# EAGLE design qnode8 (EAGLE 7.4.0)
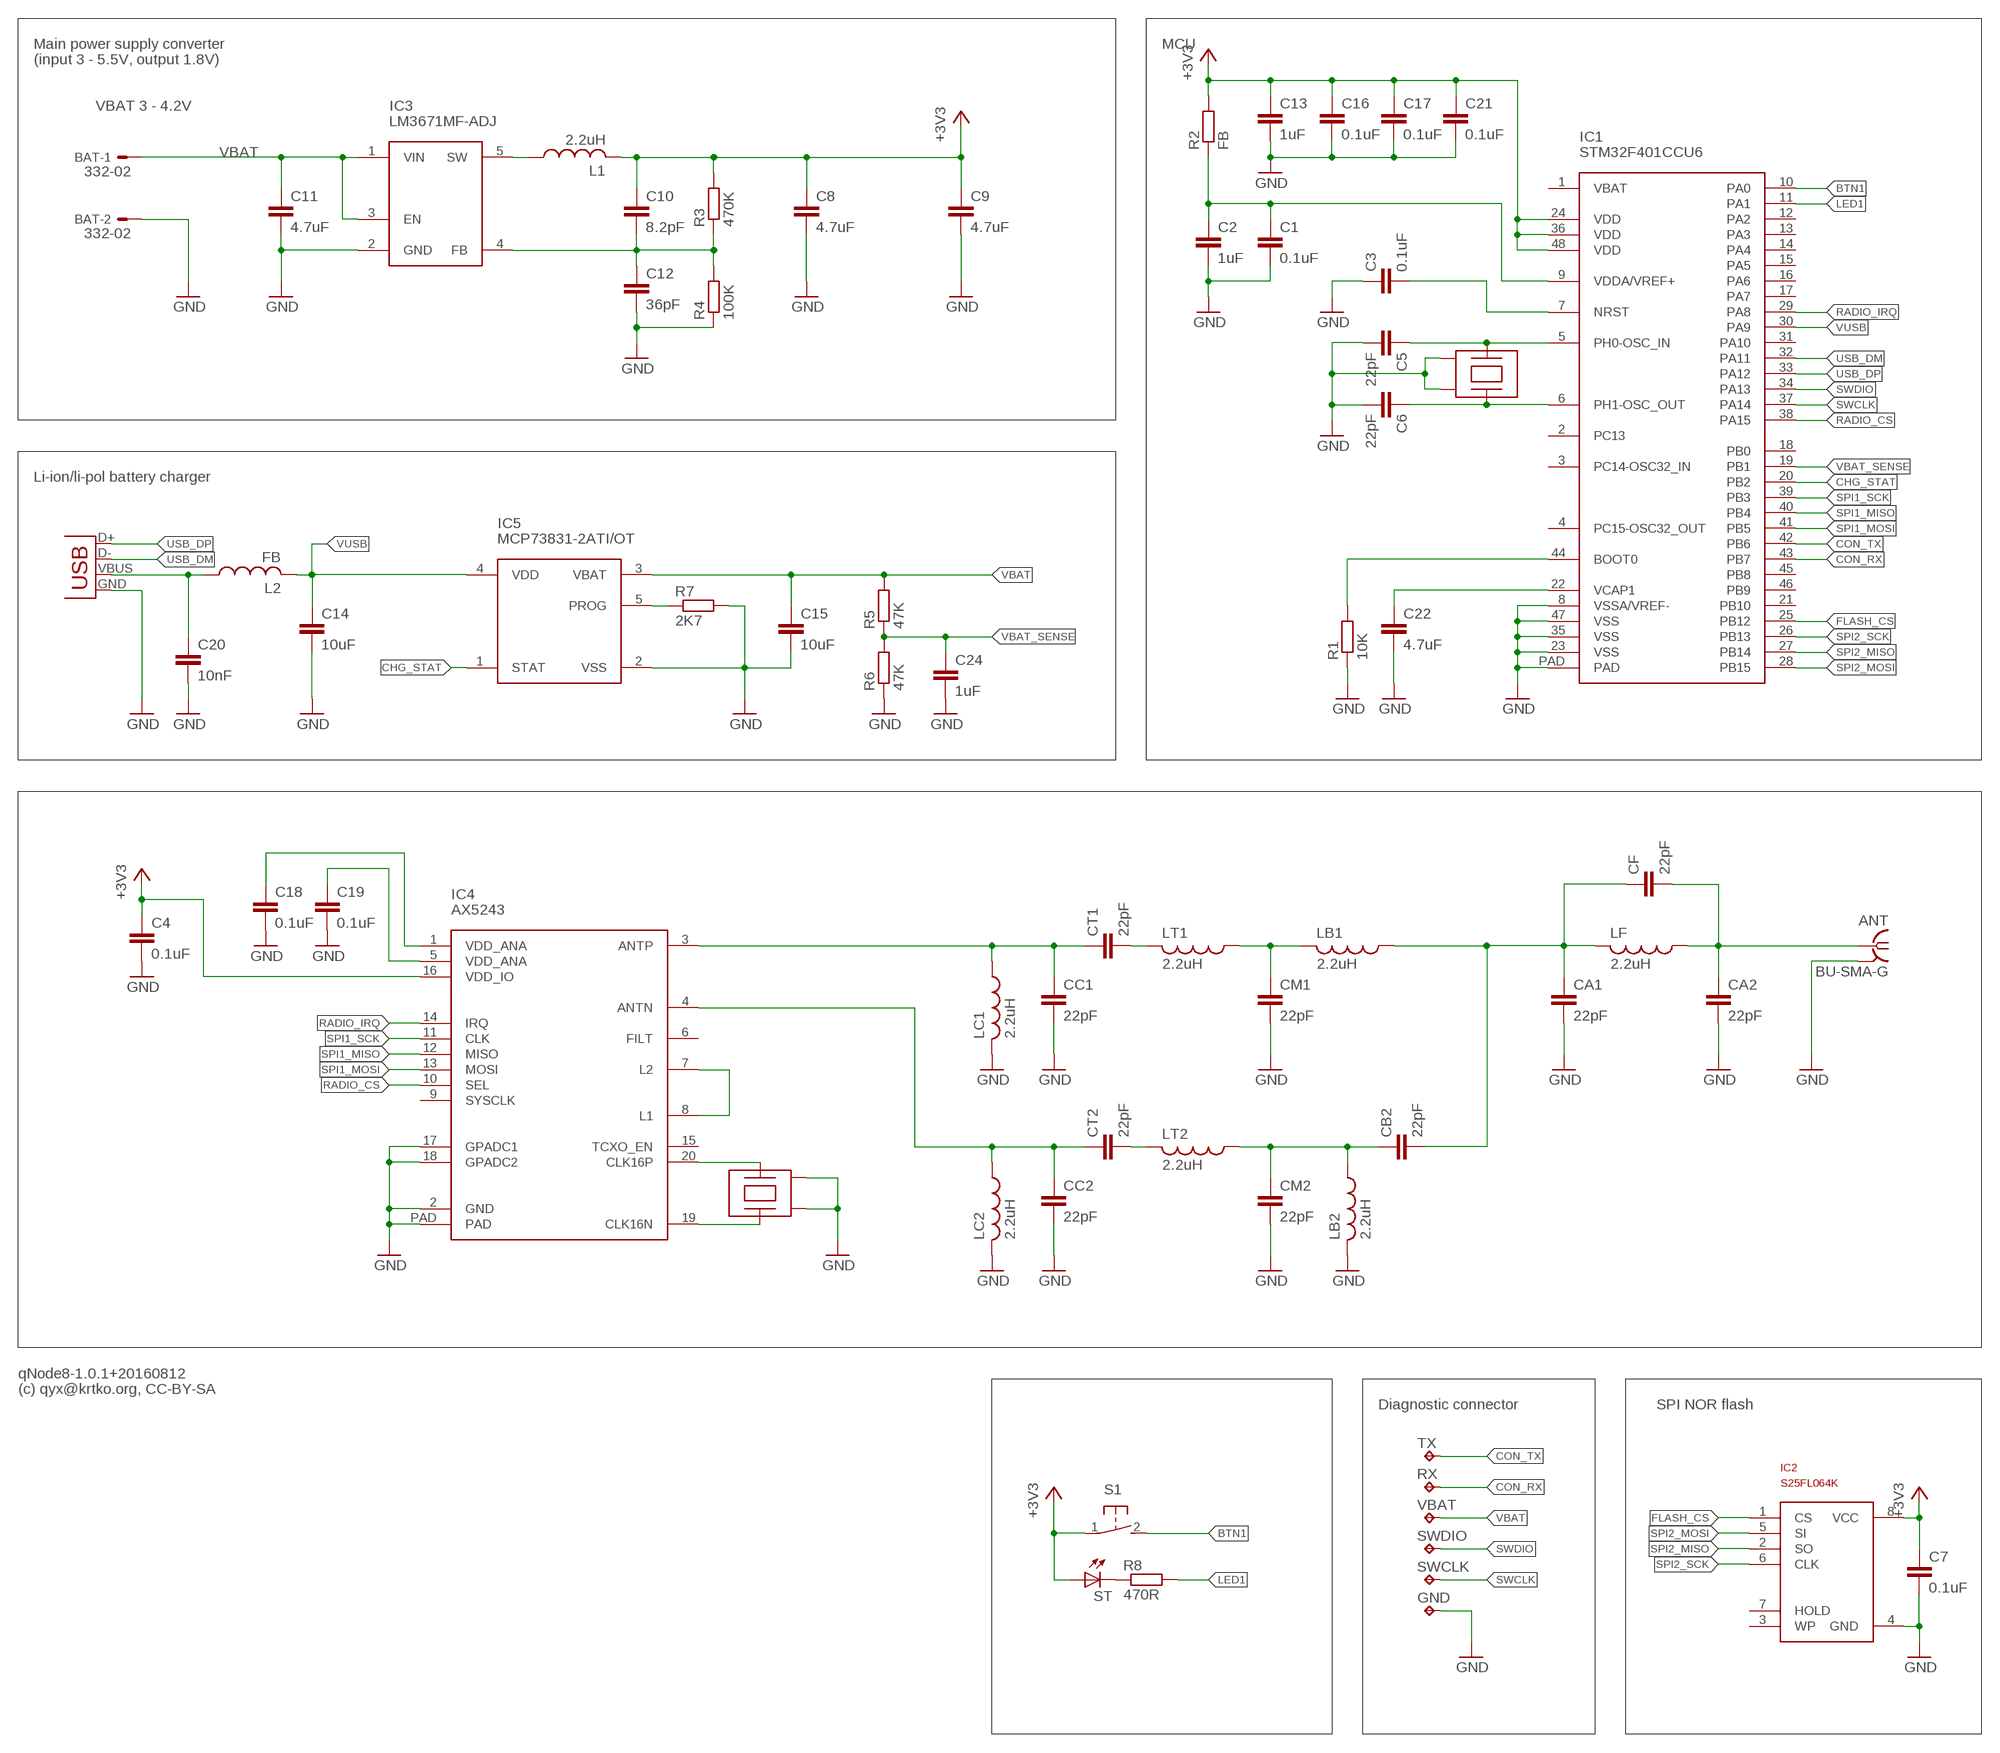
[diagram p0: schematic, sheet 1]

## Parts
ANT  BU-SMA-G  [BU-SMA-G]
BAT  332-02  [332-02]
C1  0.1uF  C-EUC0603  [C0603]
C2  1uF  C-EUC0603  [C0603]
C3  0.1uF  C-EUC0603  [C0603]
C4  0.1uF  C-EUC0603  [C0603]
C5  22pF  C-EUC0603  [C0603]
C6  22pF  C-EUC0603  [C0603]
C7  0.1uF  C-EUC0603  [C0603]
C8  4.7uF  C-EUC0805  [C0805]
C9  4.7uF  C-EUC0805  [C0805]
C10  8.2pF  C-EUC0603  [C0603]
C11  4.7uF  C-EUC0805  [C0805]
C12  36pF  C-EUC0603  [C0603]
C13  1uF  C-EUC0603  [C0603]
C14  10uF  C-EUC1206  [C1206]
C15  10uF  C-EUC1206  [C1206]
C16  0.1uF  C-EUC0603  [C0603]
C17  0.1uF  C-EUC0603  [C0603]
C18  0.1uF  C-EUC0603  [C0603]
C19  0.1uF  C-EUC0603  [C0603]
C20  10nF  C-EUC0603  [C0603]
C21  0.1uF  C-EUC0603  [C0603]
C22  4.7uF  C-EUC0603  [C0603]
C24  1uF  C-EUC0603  [C0603]
CA1  22pF  C-EUC0603  [C0603]
CA2  22pF  C-EUC0603  [C0603]
CB2  22pF  C-EUC0603  [C0603]
CC1  22pF  C-EUC0603  [C0603]
CC2  22pF  C-EUC0603  [C0603]
CF  22pF  C-EUC0603  [C0603]
CM1  22pF  C-EUC0603  [C0603]
CM2  22pF  C-EUC0603  [C0603]
CT1  22pF  C-EUC0603  [C0603]
CT2  22pF  C-EUC0603  [C0603]
GND  TPB2,54  [B2,54]
IC1  STM32F401CCU6  [UFQFPN48]
IC2  S25FL064K  [SO-08M]
IC3  LM3671MF-ADJ  LM3671MF  [SOT23-5]
IC4  AX5243  [QFN20]
IC5  MCP73831-2ATI/OT  MCP73831  [SOT23-5]
L1  2.2uH  L-USL2012C  [L2012C]
L2  FB  L-USL2012C  [L2012C]
LB1  2.2uH  L-USL2012C  [L2012C]
LB2  2.2uH  L-USL2012C  [L2012C]
LC1  2.2uH  L-USL2012C  [L2012C]
LC2  2.2uH  L-USL2012C  [L2012C]
LF  2.2uH  L-USL2012C  [L2012C]
LT1  2.2uH  L-USL2012C  [L2012C]
LT2  2.2uH  L-USL2012C  [L2012C]
R1  10K  R-EU_R0603  [R0603]
R2  FB  R-EU_R0603  [R0603]
R3  470K  R-EU_R0603  [R0603]
R4  100K  R-EU_R0603  [R0603]
R5  47K  R-EU_R0603  [R0603]
R6  47K  R-EU_R0603  [R0603]
R7  2K7  R-EU_R0603  [R0603]
R8  470R  R-EU_R0603  [R0603]
RX  TPB2,54  [B2,54]
S1  31-XX  [B3F-31XX]
ST  LED3MM  [LED3MM]
SWCLK  TPB2,54  [B2,54]
SWDIO  TPB2,54  [B2,54]
TX  TPB2,54  [B2,54]
USB  USB-MICROB  [USB-MICROB]
VBAT  TPB2,54  [B2,54]
X1  XTAL-7M  [XTAL_7M]
X2  XTAL-7M  [XTAL_7M]

## Nets
+3V3: C4.1 C7.1 C8.1 C9.1 C10.1 C13.1 C16.1 C17.1 C21.1 IC1.24(VDD) IC1.36(VDD) IC1.48(VDD) IC2.8(VCC) IC4.16(VDD_IO) L1.2 R2.2 R3.2 S1.1(P) ST.A
BTN1: IC1.10(PA0) S1.2(S)
CHG_STAT: IC1.20(PB2) IC5.1(STAT)
CON_RX: IC1.43(PB7) RX.TP
CON_TX: IC1.42(PB6) TX.TP
FLASH_CS: IC1.25(PB12) IC2.1(CS)
GND: ANT.2 ANT.3 ANT.4 ANT.5 BAT.2 C1.2 C2.2 C3.1 C4.2 C5.2 C6.2 C7.2 C8.2 C9.2 C11.2 C12.2 C13.2 C14.2 C15.2 C16.2 C17.2 C18.2 C19.2 C20.2 C21.2 C22.2 C24.2 CA1.2 CA2.2 CC1.2 CC2.2 CM1.2 CM2.2 GND.TP IC1.8(VSSA/VREF-) IC1.23(VSS) IC1.35(VSS) IC1.47(VSS) IC1.PAD IC2.4(GND) IC3.2(GND) IC4.2(GND) IC4.17(GPADC1) IC4.18(GPADC2) IC4.PAD IC5.2(VSS) LB2.2 LC1.2 LC2.2 R1.1 R4.1 R6.1 R7.2 USB.GND X1.2(G1) X1.4(G2) X2.2(G1) X2.4(G2)
LED1: IC1.11(PA1) R8.2
N$1: IC1.44(BOOT0) R1.2
N$2: C1.1 C2.1 IC1.9(VDDA/VREF+) R2.1
N$3: IC3.5(SW) L1.1
N$4: IC5.5(PROG) R7.1
N$5: C22.1 IC1.22(VCAP1)
N$6: C3.2 IC1.7(NRST)
N$7: C10.2 C12.1 IC3.4(FB) R3.1 R4.2
N$8: C5.1 IC1.5(PH0-OSC_IN) X1.1
N$9: C6.1 IC1.6(PH1-OSC_OUT) X1.3
N$10: CC1.1 CT1.1 IC4.3(ANTP) LC1.1
N$11: CC2.1 CT2.1 IC4.4(ANTN) LC2.1
N$12: IC4.7(L2) IC4.8(L1)
N$13: CA1.1 CB2.2 CF.1 LB1.1 LF.2
N$14: ANT.1 CA2.1 CF.2 LF.1
N$15: CT1.2 LT1.2
N$16: CM1.1 LB1.2 LT1.1
N$17: CT2.2 LT2.2
N$18: CB2.1 CM2.1 LB2.1 LT2.1
N$19: C18.1 IC4.1(VDD_ANA)
N$20: IC4.19(CLK16N) X2.3
N$21: IC4.20(CLK16P) X2.1
N$22: C19.1 IC4.5(VDD_ANA)
N$23: R8.1 ST.K(C)
RADIO_CS: IC1.38(PA15) IC4.10(SEL)
RADIO_IRQ: IC1.29(PA8) IC4.14(IRQ)
SPI1_MISO: IC1.40(PB4) IC4.12(MISO)
SPI1_MOSI: IC1.41(PB5) IC4.13(MOSI)
SPI1_SCK: IC1.39(PB3) IC4.11(CLK)
SPI2_MISO: IC1.27(PB14) IC2.2(SO)
SPI2_MOSI: IC1.28(PB15) IC2.5(SI)
SPI2_SCK: IC1.26(PB13) IC2.6(CLK)
SWCLK: IC1.37(PA14) SWCLK.TP
SWDIO: IC1.34(PA13) SWDIO.TP
USB_DM: IC1.32(PA11) USB.D-
USB_DP: IC1.33(PA12) USB.D+
USB_VBUS: C20.1 L2.1 USB.VBUS
VBAT: BAT.1 C11.1 C15.1 IC3.1(VIN) IC3.3(EN) IC5.3(VBAT) R5.2 VBAT.TP
VBAT_SENSE: C24.1 IC1.19(PB1) R5.1 R6.2
VUSB: C14.1 IC1.30(PA9) IC5.4(VDD) L2.2
Unconnected: IC1.1(VBAT) IC1.2(PC13) IC1.3(PC14-OSC32_IN) IC1.4(PC15-OSC32_OUT) IC1.12(PA2) IC1.13(PA3) IC1.14(PA4) IC1.15(PA5) IC1.16(PA6) IC1.17(PA7) IC1.18(PB0) IC1.21(PB10) IC1.31(PA10) IC1.45(PB8) IC1.46(PB9) IC2.3(WP) IC2.7(HOLD) IC4.6(FILT) IC4.9(SYSCLK) IC4.15(TCXO_EN)

## Notes on the sheet
- Main power supply converter | MCU
- (input 3 - 5.5V, output 1.8V)
- VBAT 3 - 4.2V
- Li-ion/li-pol battery charger
- qNode8-1.0.1+20160812
- (c) qyx@krtko.org, CC-BY-SA
- Diagnostic connector | SPI NOR flash

## Library data of the parts
ANT = con-coax:BU-SMA-G: FEMALE SMA CONNECTOR Radiall distributor RS 193-9117; OC_FARNELL: unknown; OC_NEWARK: unknown
BAT = con-garry:332-02: 2 Pin - 2mm Dual Row Source: www.mpe-connector.de / garry_shortform_2012.pdf
C1-C22 C24 CA1 CA2 CB2 CC1 CC2 CF CM1 CM2 CT1 CT2 = rcl:C-EU: CAPACITOR, European symbol
GND RX SWCLK SWDIO TX VBAT = testpad:TP: Test pad
IC1 = qyx-misc:STM32F401CCU6
IC2 = qyx-misc:S25FL064K
IC3 = qyx-misc:LM3671
IC4 = radio_transceivers:AX5243
IC5 = qyx-misc:MCP73831
L1 L2 LB1 LB2 LC1 LC2 LF LT1 LT2 = rcl:L-US: INDUCTOR, American symbol
R1-R8 = rcl:R-EU_: RESISTOR, European symbol
S1 = switch-omron:31-XX: OMRON SWITCH; MPN: B3F-3100; OC_FARNELL: 959704; OC_NEWARK: 36M3582
ST = led:LED: LED OSRAM: - CHIPLED LG R971, LG N971, LY N971, LG Q971, LY Q971, LO R971, LY R971 LH N974, LH R974 LS Q976, LO Q976, LY Q976 LO Q996 - Hyper CHIPLED LW Q18S LB Q993, LB Q99A, LB R99A - SideLED LS A670, LO A670, LY A670, LG A670, LP A670 LB A673, LV A673, LT A673, LW A673 LH A674 LY A675 LS A676, LA A676, LO A676, LY A676, LW A676 LS A679, LY A679, LG A679 - Hyper Micro SIDELED® LS Y876, LA Y876, LO Y876, LY Y876 LT Y87S - SmartLED LW L88C, LW L88S LB L89C, LB L89S, LG L890 LS L89K, LO L89K, LY L89K LS L896, LA L896, LO L896, LY L896 - TOPLED LS T670, LO T670, LY T670, LG T670, LP T670 LSG T670, LSP T670, LSY T670, LOP T670, LYG T670 LG T671, LOG T671, LSG T671 LB T673, LV T673, LT T673, LW T673 LH T674 LS T676, LA T676, LO T676, LY T676, LB T676, LH T676, LSB T676, LW T676 LB T67C, LV T67C, LT T67C, LS T67K, LO T67K, LY T67K, LW E67C LS E67B, LA E67B, LO E67B, LY E67B, LB E67C, LV E67C, LT E67C LW T67C LS T679, LY T679, LG T679 LS T770, LO T770, LY T770, LG T770, LP T770 LB T773, LV T773, LT T773, LW T773 LH T774 LS E675, LA E675, LY E675, LS T675 LS T776, LA T776, LO T776, LY T776, LB T776 LHGB T686 LT T68C, LB T68C - Hyper Mini TOPLED® LB M676 - Mini TOPLED Santana® LG M470 LS M47K, LO M47K, LY M47K Source: http://www.osram.convergy.de LUXEON: - LUMILED® LXK2-PW12-R00, LXK2-PW12-S00, LXK2-PW14-U00, LXK2-PW14-V00 LXK2-PM12-R00, LXK2-PM12-S00, LXK2-PM14-U00 LXK2-PE12-Q00, LXK2-PE12-R00, LXK2-PE12-S00, LXK2-PE14-T00, LXK2-PE14-U00 LXK2-PB12-K00, LXK2-PB12-L00, LXK2-PB12-M00, LXK2-PB14-N00, LXK2-PB14-P00, LXK2-PB14-Q00 LXK2-PR12-L00, LXK2-PR12-M00, LXK2-PR14-Q00, LXK2-PR14-R00 LXK2-PD12-Q00, LXK2-PD12-R00, LXK2-PD12-S00 LXK2-PH12-R00, LXK2-PH12-S00 LXK2-PL12-P00, LXK2-PL12-Q00, LXK2-PL12-R00 Source: www.luxeon.com KINGBRIGHT: KA-3528ASYC Source: www.kingbright.com
USB = SparkFun:USB: USB Connectors USB-B-PTH is fully proven SKU : PRT-00139 USB-miniB is fully proven SKU : PRT-00587 USB-A-PCB is untested. USB-A-H is throughly reviewed, but untested. Spark Fun Electronics SKU : PRT-00437 USB-B-SMT is throughly reviewed, but untested. Needs silkscreen touching up. USB-A-S has not been used/tested USB-MB-H has not been used/tested
X1 X2 = qyx-misc:XTAL-7M

## Board
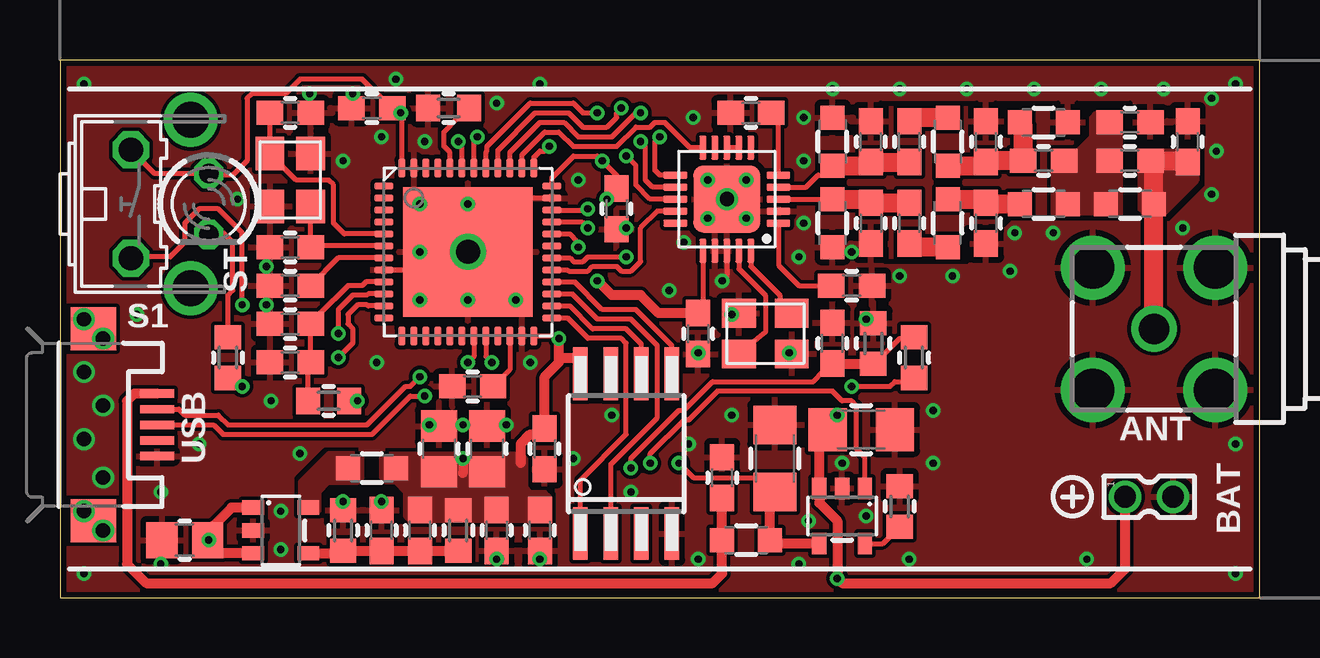
[diagram p1: board, top side]
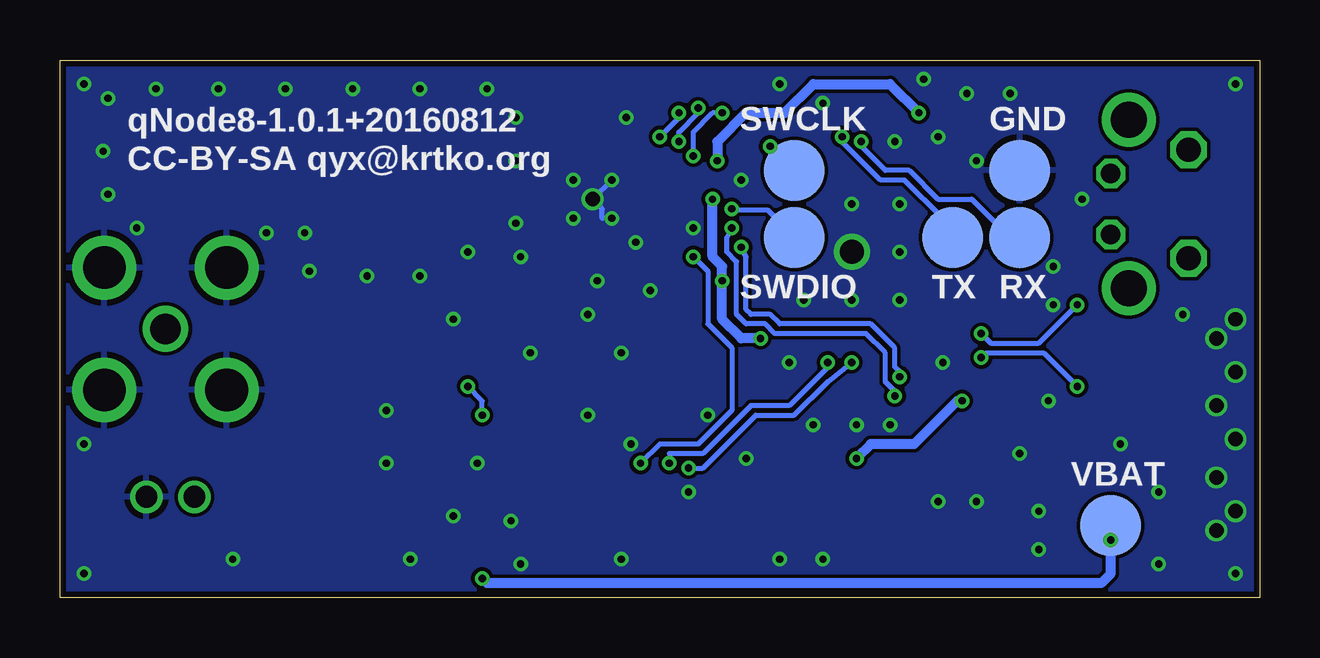
[diagram p2: board, bottom side, seen from below]

Size 50 x 22.4 mm. Coordinates in mm from the lower left corner, seen from the top.
Outline: 0,0 50,0 50,22.4 0,22.4 0,0
Copper layers (1*16): Top 0.035mm / dielectric 1.5mm / Bottom 0.035mm
Design rules "seeed": minimum track width 6mil, minimum drill 0.3mm, track to track 6mil, track to pad 6mil, pad to pad 6mil, via to via 6mil, smd to smd 0mil, copper to edge 10mil, drill to drill 10mil, minimum pad ring 6mil, minimum via ring 6mil, stop-mask expansion 2mil, vias tented up to drill 0.5mm, thermal gap 10mil
tRestrict: 35 lines

### Footprints (pad centres in the part's own frame; a part is rotated, then mirrored left to right if it is on the bottom)
BU-SMA-G = drill 1.27: 1 0,0 | drill 1.778: 2 -2.55,2.55; 3 2.55,2.55; 4 2.55,-2.55; 5 -2.55,-2.55
332-02 = drill 0.9 pad 1.27: 1 0,-1; 2 0,1
C0603 = smd 1.1 x 1: 1 -0.85,0; 2 0.85,0
C0805 = smd 1.3 x 1.5: 1 -0.95,0; 2 0.95,0
C1206 = smd 1.6 x 1.8: 1 -1.4,0; 2 1.4,0
B2,54 = smd 2.54 x 2.54: TP 0,0
UFQFPN48 = smd 0.8 x 0.3: 1 -3.5,2.75; 2 -3.5,2.25; 3 -3.5,1.75; 4 -3.5,1.25; 5 -3.5,0.75; 6 -3.5,0.25; 7 -3.5,-0.25; 8 -3.5,-0.75; 9 -3.5,-1.25; 10 -3.5,-1.75; 11 -3.5,-2.25; 12 -3.5,-2.75; 25 3.5,-2.75; 26 3.5,-2.25; 27 3.5,-1.75; 28 3.5,-1.25; 29 3.5,-0.75; 30 3.5,-0.25; 31 3.5,0.25; 32 3.5,0.75; 33 3.5,1.25; 34 3.5,1.75; 35 3.5,2.25; 36 3.5,2.75 | smd 0.3 x 0.8: 13 -2.75,-3.5; 14 -2.25,-3.5; 15 -1.75,-3.5; 16 -1.25,-3.5; 17 -0.75,-3.5; 18 -0.25,-3.5; 19 0.25,-3.5; 20 0.75,-3.5; 21 1.25,-3.5; 22 1.75,-3.5; 23 2.25,-3.5; 24 2.75,-3.5; 37 2.75,3.5; 38 2.25,3.5; 39 1.75,3.5; 40 1.25,3.5; 41 0.75,3.5; 42 0.25,3.5; 43 -0.25,3.5; 44 -0.75,3.5; 45 -1.25,3.5; 46 -1.75,3.5; 47 -2.25,3.5; 48 -2.75,3.5 | smd 5.4 x 5.4: PAD 0,0
SO-08M = smd 0.6 x 2.2: 1 -1.905,-3.33; 2 -0.635,-3.33; 3 0.635,-3.33; 4 1.905,-3.33; 5 1.905,3.33; 6 0.635,3.33; 7 -0.635,3.33; 8 -1.905,3.33
SOT23-5 = smd 0.6 x 0.9: 1 -0.95,-1.15; 2 0,-1.15; 3 0.95,-1.15; 4 0.95,1.15; 5 -0.95,1.15
QFN20 = smd 1 x 0.3: 1 -2.15,1; 2 -2.15,0.5; 3 -2.15,0; 4 -2.15,-0.5; 5 -2.15,-1; 11 2.15,-1; 12 2.15,-0.5; 13 2.15,0; 14 2.15,0.5; 15 2.15,1 | smd 0.3 x 1: 6 -1,-2.15; 7 -0.5,-2.15; 8 0,-2.15; 9 0.5,-2.15; 10 1,-2.15; 16 1,2.15; 17 0.5,2.15; 18 0,2.15; 19 -0.5,2.15; 20 -1,2.15 | smd 2.8 x 2.8: PAD 0,0
L2012C = smd 1 x 1: 1 -1,0; 2 1,0
R0603 = smd 1 x 1.1: 1 -0.85,0; 2 0.85,0
B3F-31XX = drill 1.016 octagon: 1 -2.261,-1.245; 2 2.261,-1.245 | drill 1.499 pad 2.159: 3 -3.505,1.245; 4 3.505,1.245
LED3MM = drill 0.813 octagon: A -1.27,0; K 1.27,0
USB-MICROB = smd 0.35 x 1.4: D+ 0,2.65; D- -0.65,2.65; GND 1.3,2.65; ID 0.65,2.65; VBUS -1.3,2.65 | smd 1.8 x 1.9: MT1 -4,0; MT2 4,0
XTAL_7M = smd 1.4 x 1.2: 1 -1.1,-0.85; 2 1.1,-0.85; 3 1.1,0.85; 4 -1.1,0.85

### Placement (x,y rotation side)
ANT  45.6,11.2 0 top
BAT  45.4,4.2 270 top
C1  9.6,11.4 180 top
C2  9.6,9.8 180 top
C3  9.6,13 0 top
C4  26.6,11 270 top
C5  9.6,20.2 0 top
C6  9.6,14.6 180 top
C7  18.2,2.8 270 top
C8  15.8,6.2 90 top
C9  17.8,6.2 90 top
C10  15,2.8 270 top
C11  5.2,2.4 180 top
C12  13.4,2.8 90 top
C13  20.2,6.2 270 top
C14  29.8,5.8 90 top
C15  33.4,7 0 top
C16  20,2.8 270 top
C17  23.2,16.2 270 top
C18  33,13 0 top
C19  28.8,20.2 180 top
C20  27.6,5 90 top
C21  13,20.4 180 top
C22  17.2,8.8 180 top
C24  32.2,10.6 90 top
CA1  44.6,19.8 0 top
CA2  47,19 90 top
CB2  41,18.2 0 top
CC1  33.8,15.6 270 top
CC2  33.8,19 90 top
CF  44.6,18.2 0 top
CM1  38.6,15.6 270 top
CM2  38.6,19 90 top
CT1  35.4,15.6 270 top
CT2  35.4,19 90 top
GND  10,17.8 0 bottom
IC1  17,14.4 0 top
IC2  23.6,6 0 top
IC3  9.2,2.8 270 top
IC4  27.8,16.6 180 top
IC5  32.6,3.4 180 top
L1  13,5.4 0 top
L2  28.6,2.4 0 top
LB1  41,16.4 180 top
LB2  41,19.8 0 top
LC1  32.2,15.6 270 top
LC2  32.2,19 90 top
LF  44.6,16.4 180 top
LT1  37,15.6 270 top
LT2  37,19 90 top
R1  16.2,20.4 0 top
R2  11.2,8.2 0 top
R3  16.6,2.8 90 top
R4  11.8,2.8 270 top
R5  35.6,10 270 top
R6  33.9,10.59 270 top
R7  35,3.8 90 top
R8  7,10 270 top
RX  10,15 0 bottom
S1  4.2,16.4 270 top
ST  6.2,16.4 270 top
SWCLK  19.4,17.8 0 bottom
SWDIO  19.4,15 0 bottom
TX  12.8,15 0 bottom
USB  1.4,7.2 270 top
VBAT  6.2,3 180 bottom
X1  9.6,17.4 270 top
X2  29.4,11 180 top

### Tracks (layer width: path | path; a pad name or v marks a point on that pad's centre or on a via)
+3V3  (via drill 0.3)
  Top 0.2: IC1.48 14.25,20.15 v14.2,20.2 14.05,20.2 C21.1 13.8,20.45 13.75,20.45 12.6,21.6 10,21.6 9.4,21 8,21 7.8,20.8 7.8,18.2 7.2,17.6 6.27,17.6 ST.A | ST.A 3.95,17.67 S1.1 | v12.4,8.2 R2.2 | C17.1 23.2,17.6 v22.6,18.2 22.4,18.4 21.4,18.4 20.5,17.5 IC1.36 | IC1.24 20.7,10.9 v20.8,10.8 | ST.A 6.2,17.8 | IC4.16 26.8,12.05 C4.1
  Top 0.406: C9.1 18.05,5.25 | IC2.8 21.62,9.4 21.62,9.97 20.82,9.97 20.8,10 | 19.2,5.6 19.2,6.4 19.6,6.8 19.95,6.8 C13.1 20.2,9.2 20.8,9.8 20.8,10 | v16.8,5.8 16.8,5.2 | 20.8,10 v20.8,10.8 | v22.8,16.6 22.8,16.65 C17.1 | C4.1 24.95,11.85 24.2,12.6 23,12.6 v22.4,13.2
  Bottom 0.406: v12.4,8.2 12.6,8.2 14.4,6.4 16.2,6.4 v16.8,5.8 | v22.8,16.6 22.8,14.2 22.4,13.8 v22.4,13.2 22.4,11.6 21.6,10.8 v20.8,10.8 | v14.2,20.2 15.4,21.4 18.6,21.4 19.8,20.2 21.4,20.2 22.6,19 v22.6,18.2
  pour Top (no thermals): 13.6,6 19.2,6 19.4,5.8 19.4,4.6 19.6,4.4 20.2,4.4 20.4,4.2 20.4,3.4 20.2,3.2 14.6,3.2 14.4,3.4 14.4,4.4 14,4.8 13.6,4.8 13.4,5 13.4,5.8
BTN1  (via drill 0.3)
  Top 0.2: IC1.10 12.85,12.65 12.8,12.6 12.2,12.6 11.6,12 v11.6,11 | v7.6,12.2 7.6,15.2 6.6,16.2 5.8,16.2 5.2,15.6 5.2,14.8 4.6,14.2 3.02,14.2 S1.2
  Bottom 0.2: v11.6,11 11.2,10.6 9.2,10.6 v7.6,12.2
CHG_STAT  (via drill 0.3)
  Top 0.2: IC1.20 17.75,10.05 v18,9.8 | IC5.1 33.55,5.85 33.2,6.2 33.2,8 33,8.2 32.6,8.2 32.2,8.6 27.4,8.6 26.2,7.4 26,7.4 24.6,6 v24.6,5.6
  Bottom 0.2: v18,9.8 18,9.6 19.6,8 21.2,8 23.2,6 24.6,6 v24.6,5.6
CON_RX  (via drill 0.3)
  Top 0.2: IC1.43 16.75,18.75 v16.6,19
  Bottom 0.2: v16.6,19 16.6,18.8 15.6,17.8 14.6,17.8 13.4,16.6 12,16.6 10.8,15.4 10.4,15.4 RX.TP
CON_TX  (via drill 0.3)
  Top 0.2: IC1.42 17.25,19.05 v17.4,19.2
  Bottom 0.2: v17.4,19.2 17.4,19 15.8,17.4 14.8,17.4 13.2,15.8 13.2,15.4 TX.TP
FLASH_CS
  Top 0.2: IC1.25 21.15,11.65 22,10.8 23.4,10.8 23.6,10.6 23.6,6.8 21.7,4.89 IC2.1
GND  (via drill 0.3, 0.6, 1)
  Top 0.2: IC4.18 27.8,13.4 v27.6,13.2 | IC1.8 14.75,13.65 | 14.75,13.65 14.8,13.6 | 14.75,13.65 14.75,13.95 IC1.PAD | IC1.35 19.05,16.65 19,16.6
  Bottom 0.2: v27,15.8 27.4,15.8 27.4,16.2 IC4.PAD v27,17.4
  other vias: 17,14.4 20,21.4 31,18.2 31,15.6 30.8,14.2 33,14.4 33.6,11.6 35,13.4 37.2,13.4 39.6,13.6 39.8,15.2 41.4,15.2 48,20.8 46,21.2 43.4,21.2 40.6,21.2 37.8,21.2 35,21.2 32.2,21.2 31,20 49,21.4 49,1 49,6.4 48,16.8 35.4,1.6 20,1.6 4.2,1.4 1,1 3.2,11.8 1,21.4 10.4,21 48.2,18.6 46.8,15.4 28.6,15.8 28.6,17.4 15.2,19 17,12.4 15,16.4 11.8,18.2 13.4,19.2 18.2,20.6 19.6,9.8 11.8,4 13.4,4 9.2,2 9.2,3.6 18.2,1.6 21.4,5.8 18.6,7.2 16.8,7.2 15.4,7.2 13.2,9.8 8.8,8.2 10,6 23,7.6 28,11.8 4.2,4.4 5.8,6.4 1,11.6 1.8,10.8 1,3.6 1.8,2.8 1,9.4 1.8,8 1,6.6 1.8,5 28,7.6 23.8,4.4 30.4,10.2 42.8,1.6 8.6,12.2 8.6,13.8 15,14.4 15,12.4 17,16.4 19,12.4 23.6,15.4 21.6,17.4 12.2,21 27.8,16.6 32.6,5.6 33.6,3.4 14,21.6 26.6,10.2 36.4,7.8 36.4,5.6 26.6,1.6 31.2,3.2 30.8,1.4 26.4,20 7.4,16.6 26.2,6.4 26,14.8 25.4,12.8
  pour Top (rank 2): 0,0 50,0 50,22.4 0,22.4
  pour Bottom (rank 2): 0,0 50,0 50,22.4 0,22.4
LED1  (via drill 0.3)
  Top 0.2: v11.6,10 12.2,10.6 12.2,11.2 12,11.4 12,11.8 12.4,12.2 12.8,12.2 12.85,12.15 IC1.11 | R8.2 7.25,9.15 v7.6,8.8
  Bottom 0.2: v11.6,10 11.4,10.2 9,10.2 v7.6,8.8
N$1
  Top 0.2: IC1.44 16.25,18.55 16,18.8 16,19.4 16.6,20 16.85,20 R1.2
N$2
  Top 0.2: R2.1 10.35,9.7 C2.1 C1.1 10.8,11.75 10.8,11.8 12,13 12.6,13 12.75,13.15 IC1.9
N$3
  pour Top (no thermals): 10,3.6 10.8,3.6 10.8,4.4 11.2,4.8 12.4,4.8 12.6,5 12.6,5.8 12.4,6 11.2,6 10,4.8
N$4
  Top 0.2: IC5.5 34.3,2.25 R7.1
N$5
  Top 0.2: IC1.22 18.75,9.5 C22.1
N$6
  Top 0.2: IC1.7 11.6,14.15 C3.2
N$7
  Top 0.406: IC3.4 11.7,1.85 R4.2 C12.1 C10.2 R3.1
N$8
  Top 0.2: C5.1 X1.1 9.85,17.4 11.2,17.4 11.4,17.2 11.4,15.6 11.85,15.15 IC1.5
N$9
  Top 0.2: IC1.6 10.5,14.65 C6.1 X1.3
N$10
  Top 0.2: IC4.3 LC1.1
  Top 0.8: LC1.1 33.65,16.6 CC1.1 CT1.1
N$11
  Top 0.2: IC4.4 31.1,17.1 31.6,17.6 31.8,17.6 LC2.1
  Top 0.8: LC2.1 33.65,18 CC2.1 CT2.1
N$12
  Top 0.2: IC4.7 IC4.8
N$13
  pour Top (no thermals): 41.4,18.6 42.4,18.6 43,19.2 43,20 43.2,20.2 44.2,20.2 44.2,16 41.4,16
N$14
  Top 0.8: ANT.1 LF.1 45.6,18.05 CF.2 46.95,18.2 CA2.1
  pour Top (no thermals): 45.2,16 46,16 47.4,17.4 47.4,18.6 45,18.6 45,16.2
N$15
  Top 0.8: LT1.2 35.55,14.6 CT1.2
N$16
  Top 0.8: LT1.1 38.45,16.6 CM1.1 38.65,16.4 LB1.2
N$17
  Top 0.8: LT2.2 35.55,20 CT2.2
N$18
  Top 0.8: LT2.1 38.45,18 CM2.1 38.65,18.2 CB2.1 40.15,19.65 LB2.1
N$19
  Top 0.2: IC4.1 29.95,13.85 30.8,13 C18.1
N$20
  Top 0.2: IC4.19 28.3,13.7 29.4,12.6 29.4,11.05 X2.3
N$21
  Top 0.2: IC4.20 28.8,13.8 30,12.6 30,12.15 X2.1
N$22
  Top 0.2: IC4.5 29.95,20.1 C19.1
N$23
  Top 0.2: R8.1 7,12.6 7.2,12.8 7.2,14.8 6.8,15.2 6.27,15.2 ST.K
RADIO_CS
  Top 0.2: IC1.38 19.25,18.45 20.2,19.4 20.8,19.4 21.4,18.8 23.2,18.8 24,19.6 24.6,19.6 24.8,19.8 25.2,19.8 26.25,18.75 IC4.10
RADIO_IRQ
  Top 0.2: IC4.14 24.9,16.1 24.2,15.4 24.2,14 23.8,13.6 23.4,13.6 23.2,13.8 22.2,13.8 22,13.6 21.2,13.6 21.15,13.65 IC1.29
SPI1_MISO  (via drill 0.3)
  Top 0.2: IC1.40 18.25,18.65 19.8,20.2 21.2,20.2 21.8,19.6 22.8,19.6 23.2,20 23.2,20.2 v23.4,20.4 | IC4.12 24.7,17.1 24.4,17.4 24.4,18.8 v24.2,19
  Bottom 0.2: v24.2,19 24.2,19.4 23.4,20.2 v23.4,20.4
SPI1_MOSI  (via drill 0.3)
  Top 0.2: IC1.41 17.75,18.55 17.8,18.6 17.8,18.8 19.6,20.6 21.4,20.6 21.8,20.2 v22.4,20.2 | IC4.13 24.6,16.6 24,17.2 24,18 v23.6,18.4
  Bottom 0.2: v23.6,18.4 23.6,19.4 22.8,20.2 v22.4,20.2
SPI1_SCK  (via drill 0.3)
  Top 0.2: IC1.39 18.75,18.55 20,19.8 21,19.8 21.6,19.2 23,19.2 24,20.2 v24.2,20.2 | IC4.11 25,17.6 24.8,17.8 24.8,19 v25,19.2
  Bottom 0.2: v24.2,20.2 24.2,20 v25,19.2
SPI2_MISO
  Top 0.2: IC1.27 21.35,12.65 22.4,11.6 23.8,11.6 24.9,10.5 24.9,7.5 22.96,5.57 IC2.2
SPI2_MOSI
  Top 0.2: IC1.28 21.45,13.15 22.6,12 24,12 25.5,10.49 IC2.5
SPI2_SCK
  Top 0.2: IC1.26 21.25,12.15 22.2,11.2 23.6,11.2 24.23,10.56 IC2.6
SWCLK  (via drill 0.3)
  Top 0.2: IC1.37 19.75,18.35 20,18.6 20.2,18.6 v20.4,18.8
  Bottom 0.2: SWCLK.TP v20.4,18.8
SWDIO  (via drill 0.3)
  Top 0.2: IC1.34 21.95,16.15 v22,16.2
  Bottom 0.2: SWDIO.TP 19.4,15.05 IC1.34 21.95,16.15 v22,16.2
USB_DM  (via drill 0.3)
  Top 0.2: USB.D- 4.95,7.85 5.2,7.6 6.6,7.6 7,7.2 12.8,7.2 14.4,8.8 14.6,8.8 v15,9.2 | IC1.32 21.25,15.15 21.6,14.8 v21.6,14.6
  Bottom 0.2: v15,9.2 15,9.4 15.2,9.6 15.2,10.4 16.2,11.4 20,11.4 20.4,11.8 21.2,11.8 21.4,12 21.4,14.2 v21.6,14.6
USB_DP  (via drill 0.3)
  Top 0.2: USB.D+ 6.4,7.2 6.8,6.8 13,6.8 14.6,8.4 v15.2,8.4 | IC1.33 21.75,15.65 v22,15.4
  Bottom 0.2: v15.2,8.4 15.2,8.6 15.6,9 15.6,10.2 16.4,11 20.2,11 20.6,11.4 21.4,11.4 21.8,11.8 21.8,14 22.2,14.4 22.2,15 v22,15.4
USB_VBUS
  Top 0.406: USB.VBUS 3.1,8.5 2.8,8.2 2.8,1.4 3.6,0.6 27.2,0.6 27.6,1 L2.1 C20.1
VBAT  (via drill 0.3)
  Top 0.2: v33,8.8 34.6,8.8 34.8,9 35.45,9 R5.2 | C15.1 32,7.2 v32.4,7.6
  Top 0.406: C11.1 6.4,2.65 6.4,3 7.15,3.75 IC3.1 8.15,3.75 | IC3.3 6.7,1.85 C11.1 | C15.1 31.65,6.65 IC5.3 31.65,3.95 32.4,3.2 v32.4,0.8 32.6,0.6 43.8,0.6 44.4,1.2 BAT.1 | C11.1 v6.2,2.4
  Bottom 0.2: v32.4,7.6 32.4,8.2 v33,8.8
  Bottom 0.406: VBAT.TP v6.2,2.4 6.2,1 6.6,0.6 32.2,0.6 v32.4,0.8
VBAT_SENSE  (via drill 0.3)
  Top 0.2: v23.8,5.4 23.8,5.8 25.8,7.8 26,7.8 27.2,9 31.4,9 31.8,9.4 31.85,9.4 C24.1 | R6.2 33.94,9.74 35,10.8 35.55,10.8 R5.1 | IC1.19 17.25,10.05 v17,9.8
  Top 0.406: C24.1 R6.2
  Bottom 0.2: v23.8,5.4 23.2,5.4 21,7.6 19.4,7.6 18,9 v17,9.8
VUSB  (via drill 0.3)
  Top 0.2: C14.1 29.2,5 26.4,5 v25.8,5.6 | IC1.30 21.25,14.15 21.4,14 21.8,14 22,14.2 v23.6,14.2
  Top 0.406: IC5.4 29.55,2.25 L2.2 29.6,4.2 C14.1
  Bottom 0.2: v23.6,14.2 23,13.6 23,11.4 22,10.4 22,7.8 23.4,6.4 25,6.4 v25.8,5.6

### Text on the board
bNames: qNode8-1.0.1+20160812 | CC-BY-SA qyx@krtko.org